# EAGLE design hub_moteurs (EAGLE 7.4.0)
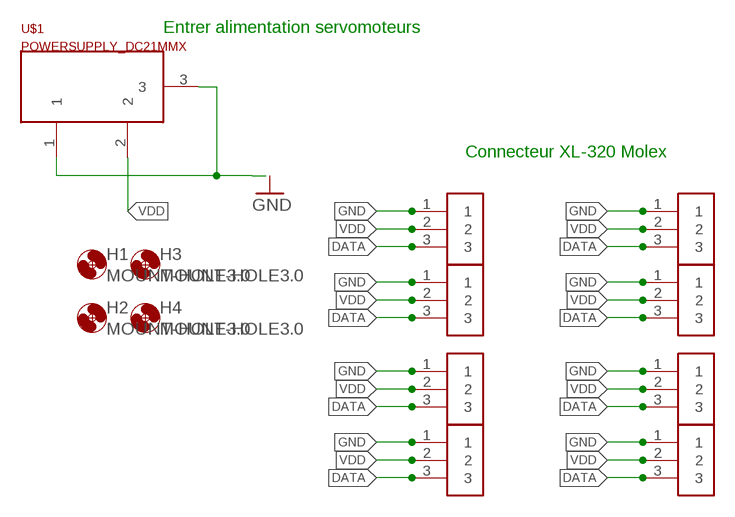
[diagram p0: schematic, sheet 1]

## Parts
H1  MOUNT-HOLE3.0  [3,0]
H2  MOUNT-HOLE3.0  [3,0]
H3  MOUNT-HOLE3.0  [3,0]
H4  MOUNT-HOLE3.0  [3,0]
U$1  POWERSUPPLY_DC21MMX  [POWERSUPPLY_DC-21MM]
U$2  CON_XL-320  CON_XL-3éà  [CON_XL-320]
U$3  CON_XL-320  CON_XL-3éà  [CON_XL-320]
U$4  CON_XL-320  CON_XL-3éà  [CON_XL-320]
U$5  CON_XL-320  CON_XL-3éà  [CON_XL-320]
U$6  CON_XL-320  CON_XL-3éà  [CON_XL-320]
U$7  CON_XL-320  CON_XL-3éà  [CON_XL-320]
U$8  CON_XL-320  CON_XL-3éà  [CON_XL-320]
U$9  CON_XL-320  CON_XL-3éà  [CON_XL-320]

## Nets
DATA: U$2.3 U$3.3 U$4.3 U$5.3 U$6.3 U$7.3 U$8.3 U$9.3
GND: U$1.1 U$1.3 U$2.1 U$3.1 U$4.1 U$5.1 U$6.1 U$7.1 U$8.1 U$9.1
VDD: U$1.2 U$2.2 U$3.2 U$4.2 U$5.2 U$6.2 U$7.2 U$8.2 U$9.2

## Notes on the sheet
- Entrer alimentation servomoteurs
- Connecteur XL-320 Molex

## Library data of the parts
H1-H4 = holes:MOUNT-HOLE: MOUNTING HOLE with drill center marker
U$1 = SmartPrj:POWERSUPPLY_DC21MM
U$2-U$9 = heol_project:CON_XL-3éà

## Board
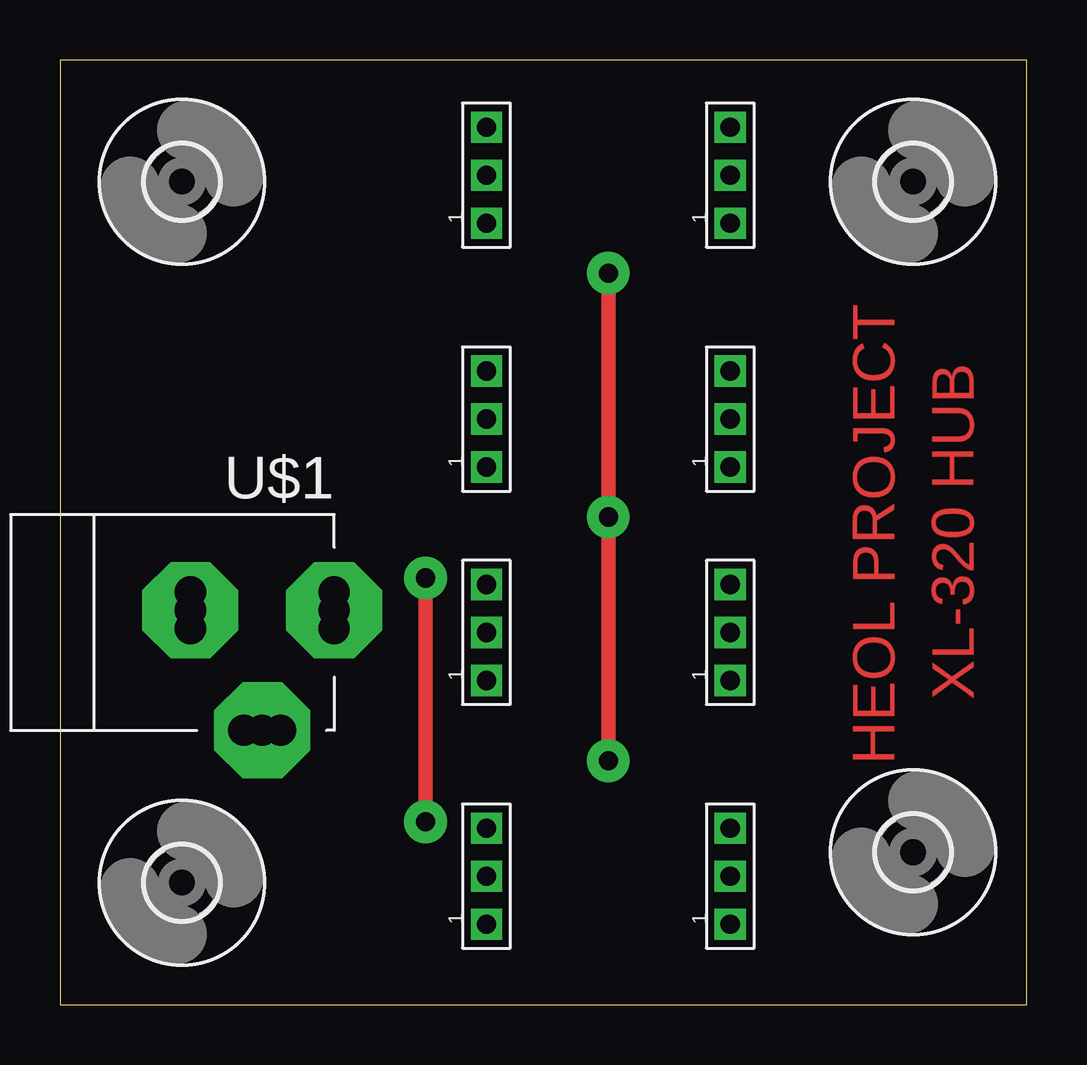
[diagram p1: board, top side]
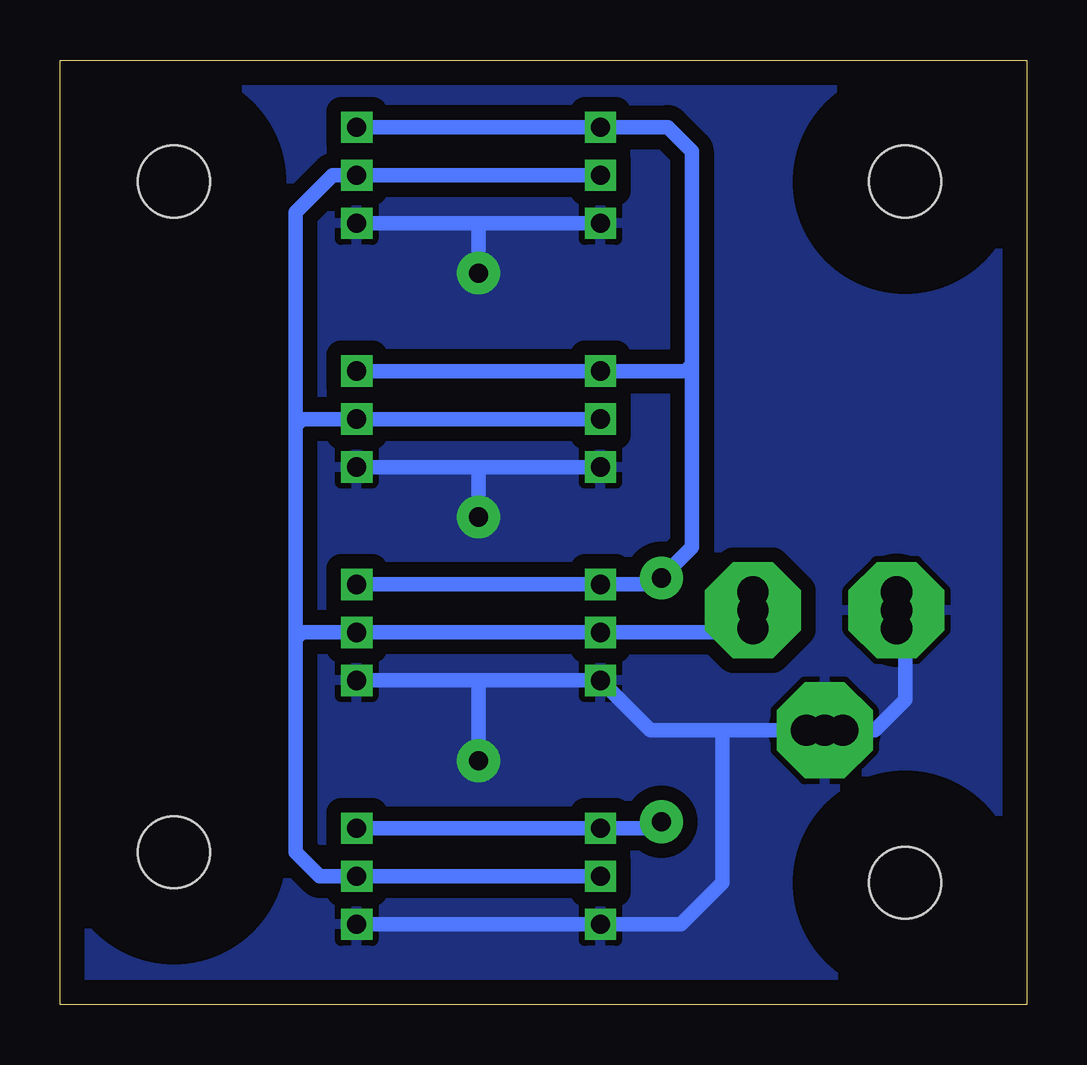
[diagram p2: board, bottom side, seen from below]

Size 40.31 x 39.36 mm. Coordinates in mm from the lower left corner, seen from the top.
Outline: 0,0 40.31,0 40.31,39.36 0,39.36 0,0
Copper layers (1*16): Top 0.035mm / dielectric 1.5mm / Bottom 0.035mm
Design rules "default": minimum track width 10mil, minimum drill 24mil, track to track 8mil, track to pad 8mil, pad to pad 8mil, via to via 8mil, smd to smd 8mil, copper to edge 40mil, drill to drill 8mil, minimum pad ring 10mil, minimum via ring 8mil, stop-mask expansion 4mil, vias tented up to drill 0mil, thermal gap 10mil

### Footprints (pad centres in the part's own frame; a part is rotated, then mirrored left to right if it is on the bottom)
3,0 = hole 3: 0,0
POWERSUPPLY_DC-21MM = drill 1.3 pad 4 octagon: 1 -5.08,-3.353; 2 -0.076,-6.35; 3 -0.076,-0.356 | drill 1.3: 4 -5.08,-4.115; 5 -5.08,-2.591; 6 -0.838,-0.356; 7 0.686,-0.356; 8 -0.838,-6.35; 9 0.686,-6.35
CON_XL-320 = drill 0.8 square: 1 -3,0; 2 -1,0; 3 1,0

### Placement (x,y rotation side)
H1  35.56,6.35 0 top
H2  35.56,34.29 0 top
H3  5.08,34.29 0 top
H4  5.08,5.08 0 top
U$1  5.08,16.51 90 top
U$2  17.78,35.56 90 top
U$3  27.94,6.35 90 top
U$4  17.78,16.51 90 top
U$5  27.94,16.51 90 top
U$6  17.78,6.35 90 top
U$7  27.94,35.56 90 top
U$8  27.94,25.4 90 top
U$9  17.78,25.4 90 top

### Tracks (layer width: path | path; a pad name or v marks a point on that pad's centre or on a via)
DATA  (via drill 0.8 pad 1.78)
  Top 0.61: v15.24,7.62 v15.24,17.78
  Bottom 0.61: U$2.3 U$7.3 14.97,36.56 13.97,35.56 13.97,26.67 | U$9.3 U$8.3 14.24,26.4 13.97,26.67 | U$5.3 U$4.3 15.51,17.51 v15.24,17.78 13.97,19.05 13.97,26.67 | U$3.3 U$6.3 15.51,7.35 v15.24,7.62
GND  (via drill 0.8 pad 1.78)
  Top 0.61: v22.86,30.48 v22.86,20.32 v22.86,10.16
  Bottom 0.61: U$1.3 5.08,16.08 5.08,12.7 6.35,11.43 U$1.1 12.7,11.43 | U$6.1 U$3.1 14.43,3.35 12.7,5.08 12.7,11.43 | 22.86,13.51 U$4.1 15.7,11.43 12.7,11.43 | 22.86,13.51 U$5.1 | U$2.1 U$7.1 22.86,32.56 v22.86,30.48 | U$9.1 U$8.1 22.86,22.4 v22.86,20.32 | v22.86,10.16 22.86,13.51
  pour Bottom (isolate 0.61): 0,39.37 0,0 40.64,0 40.64,39.37
VDD
  Bottom 0.61: U$6.2 U$3.2 29.48,5.35 30.48,6.35 30.48,15.24 | U$8.2 U$9.2 30.21,24.4 30.48,24.13 | U$2.2 U$7.2 28.94,34.56 30.48,33.02 30.48,24.13 | U$1.2 12.35,15.51 U$4.2 U$5.2 30.21,15.51 30.48,15.24 | 30.48,15.24 30.48,24.13

### Text on the board
Top: HEOL PROJECT | XL-320 HUB